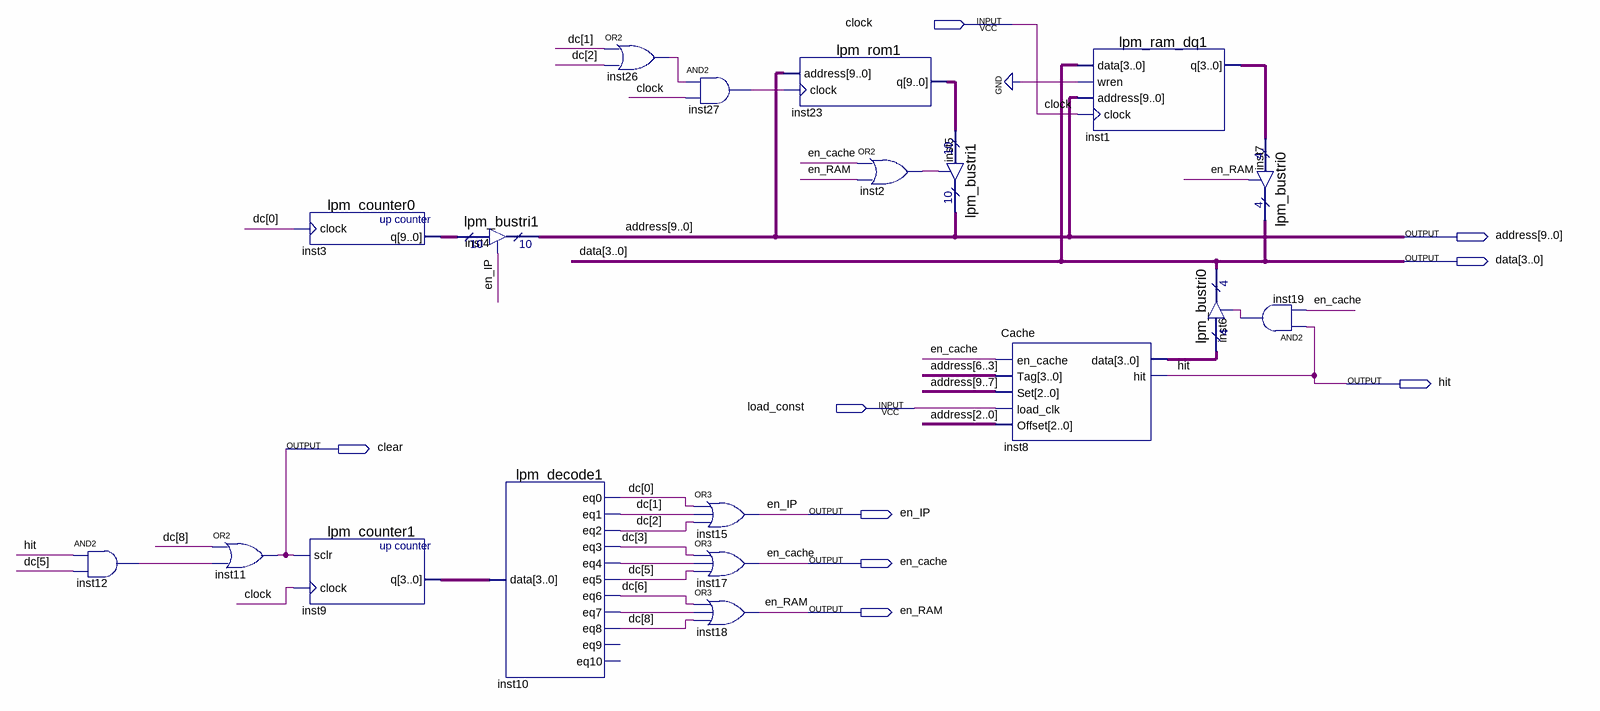
[diagram p0: schematic sheet]
// Quartus schematic Main.bdf as structural Verilog: 19 symbols, 9 pins
module Main (
  input  clock,
  input  load_const,
  output [9:0] address,
  output [3:0] data,
  output hit,
  output clear,
  output en_IP,
  output en_cache,
  output en_RAM
);

  wire inst2_out, inst10_eq4, inst10_eq7, inst12_out, inst19_out, inst26_out, inst27_out;
  wire [3:0] inst1_q, inst8_data, inst9_q;
  wire [8:0] dc;
  wire [9:0] inst3_q, inst23_q;

  and inst12 (inst12_out, hit, dc[5]);
  or inst11 (clear, dc[8], inst12_out);
  lpm_counter0 inst3 (.clock(dc[0]), .q(inst3_q));
  lpm_counter1 inst9 (.sclr(clear), .clock(clock), .q(inst9_q));
  lpm_bustri1 inst4 (.enabledt(en_IP), .data(inst3_q), .tridata(address));
  lpm_decode1 inst10 (
    .data(inst9_q), .eq0(dc[0]), .eq1(dc[1]), .eq2(dc[2]), .eq3(dc[3]), .eq4(inst10_eq4), .eq5(dc[5]),
    .eq6(dc[6]), .eq7(inst10_eq7), .eq8(dc[8]));  // open: eq9, eq10
  or inst26 (inst26_out, dc[1], dc[2]);
  and inst27 (inst27_out, inst26_out, clock);
  or inst15 (en_IP, dc[0], dc[1], dc[2]);
  or inst17 (en_cache, dc[3], inst10_eq4, dc[5]);
  or inst18 (en_RAM, dc[6], inst10_eq7, dc[8]);
  lpm_rom1 inst23 (.address(address), .clock(inst27_out), .q(inst23_q));
  or inst2 (inst2_out, en_cache, en_RAM);
  lpm_bustri1 inst5 (.enabledt(inst2_out), .data(inst23_q), .tridata(address));
  Cache inst8 (
    .en_cache(en_cache), .Tag(address[6:3]), .Set(address[9:7]), .load_clk(load_const),
    .Offset(address[2:0]), .data(inst8_data), .hit(hit));
  lpm_ram_dq1 inst1 (.data(data), .wren(1'b0), .address(address), .clock(clock), .q(inst1_q));
  lpm_bustri0 inst6 (.enabledt(inst19_out), .data(inst8_data), .tridata(data));
  lpm_bustri0 inst7 (.enabledt(en_RAM), .data(inst1_q), .tridata(data));
  and inst19 (inst19_out, hit, en_cache);
endmodule
